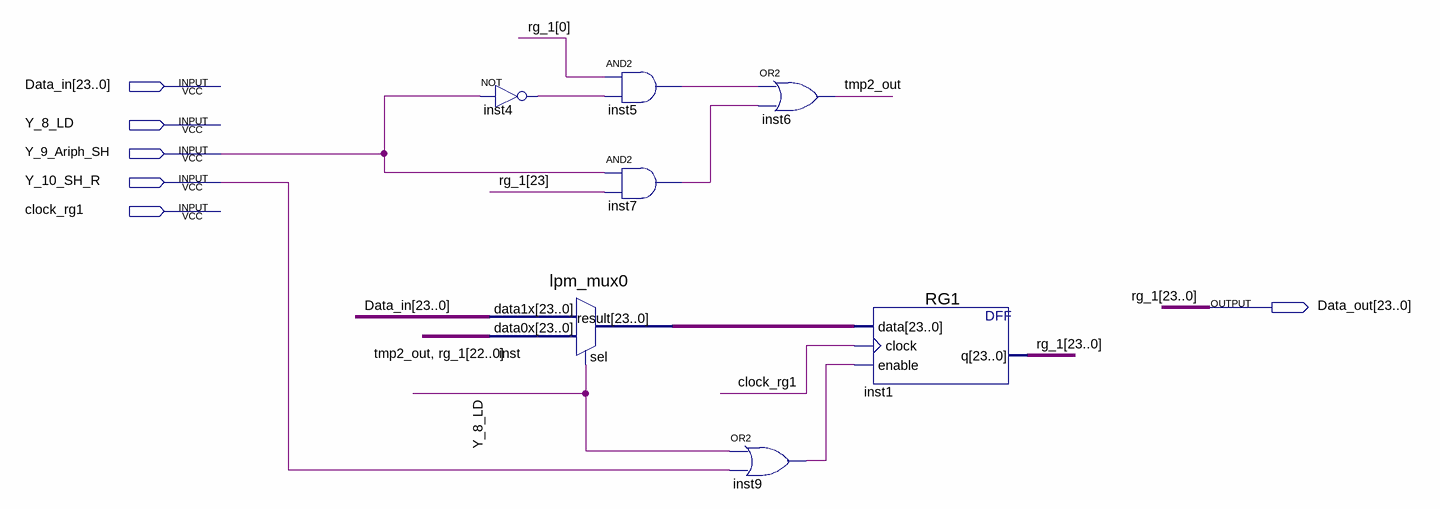
[diagram p0: schematic sheet]
// Quartus schematic RG1_block.bdf as structural Verilog: 7 symbols, 6 pins
module RG1_block (
  input  [23:0] Data_in,
  input  Y_8_LD,
  input  Y_9_Ariph_SH,
  input  Y_10_SH_R,
  input  clock_rg1,
  output [23:0] Data_out
);

  wire inst4_out, inst5_out, inst7_out, inst9_out, tmp2_out;
  wire [23:0] inst_result;

  not inst4 (inst4_out, Y_9_Ariph_SH);
  lpm_mux0 inst (.data1x(Data_in), .data0x({tmp2_out, Data_out[22:0]}), .sel(Y_8_LD), .result(inst_result));
  and inst5 (inst5_out, Data_out[0], inst4_out);
  and inst7 (inst7_out, Y_9_Ariph_SH, Data_out[23]);
  or inst9 (inst9_out, Y_8_LD, Y_10_SH_R);
  or inst6 (tmp2_out, inst5_out, inst7_out);
  RG1 inst1 (.data(inst_result), .clock(clock_rg1), .enable(inst9_out), .q(Data_out));

  // Other names for the same wires on the sheet: rg_1[23:0] = Data_out
endmodule
